# EAGLE board Full (EAGLE 9.6.2), part 1 of 3
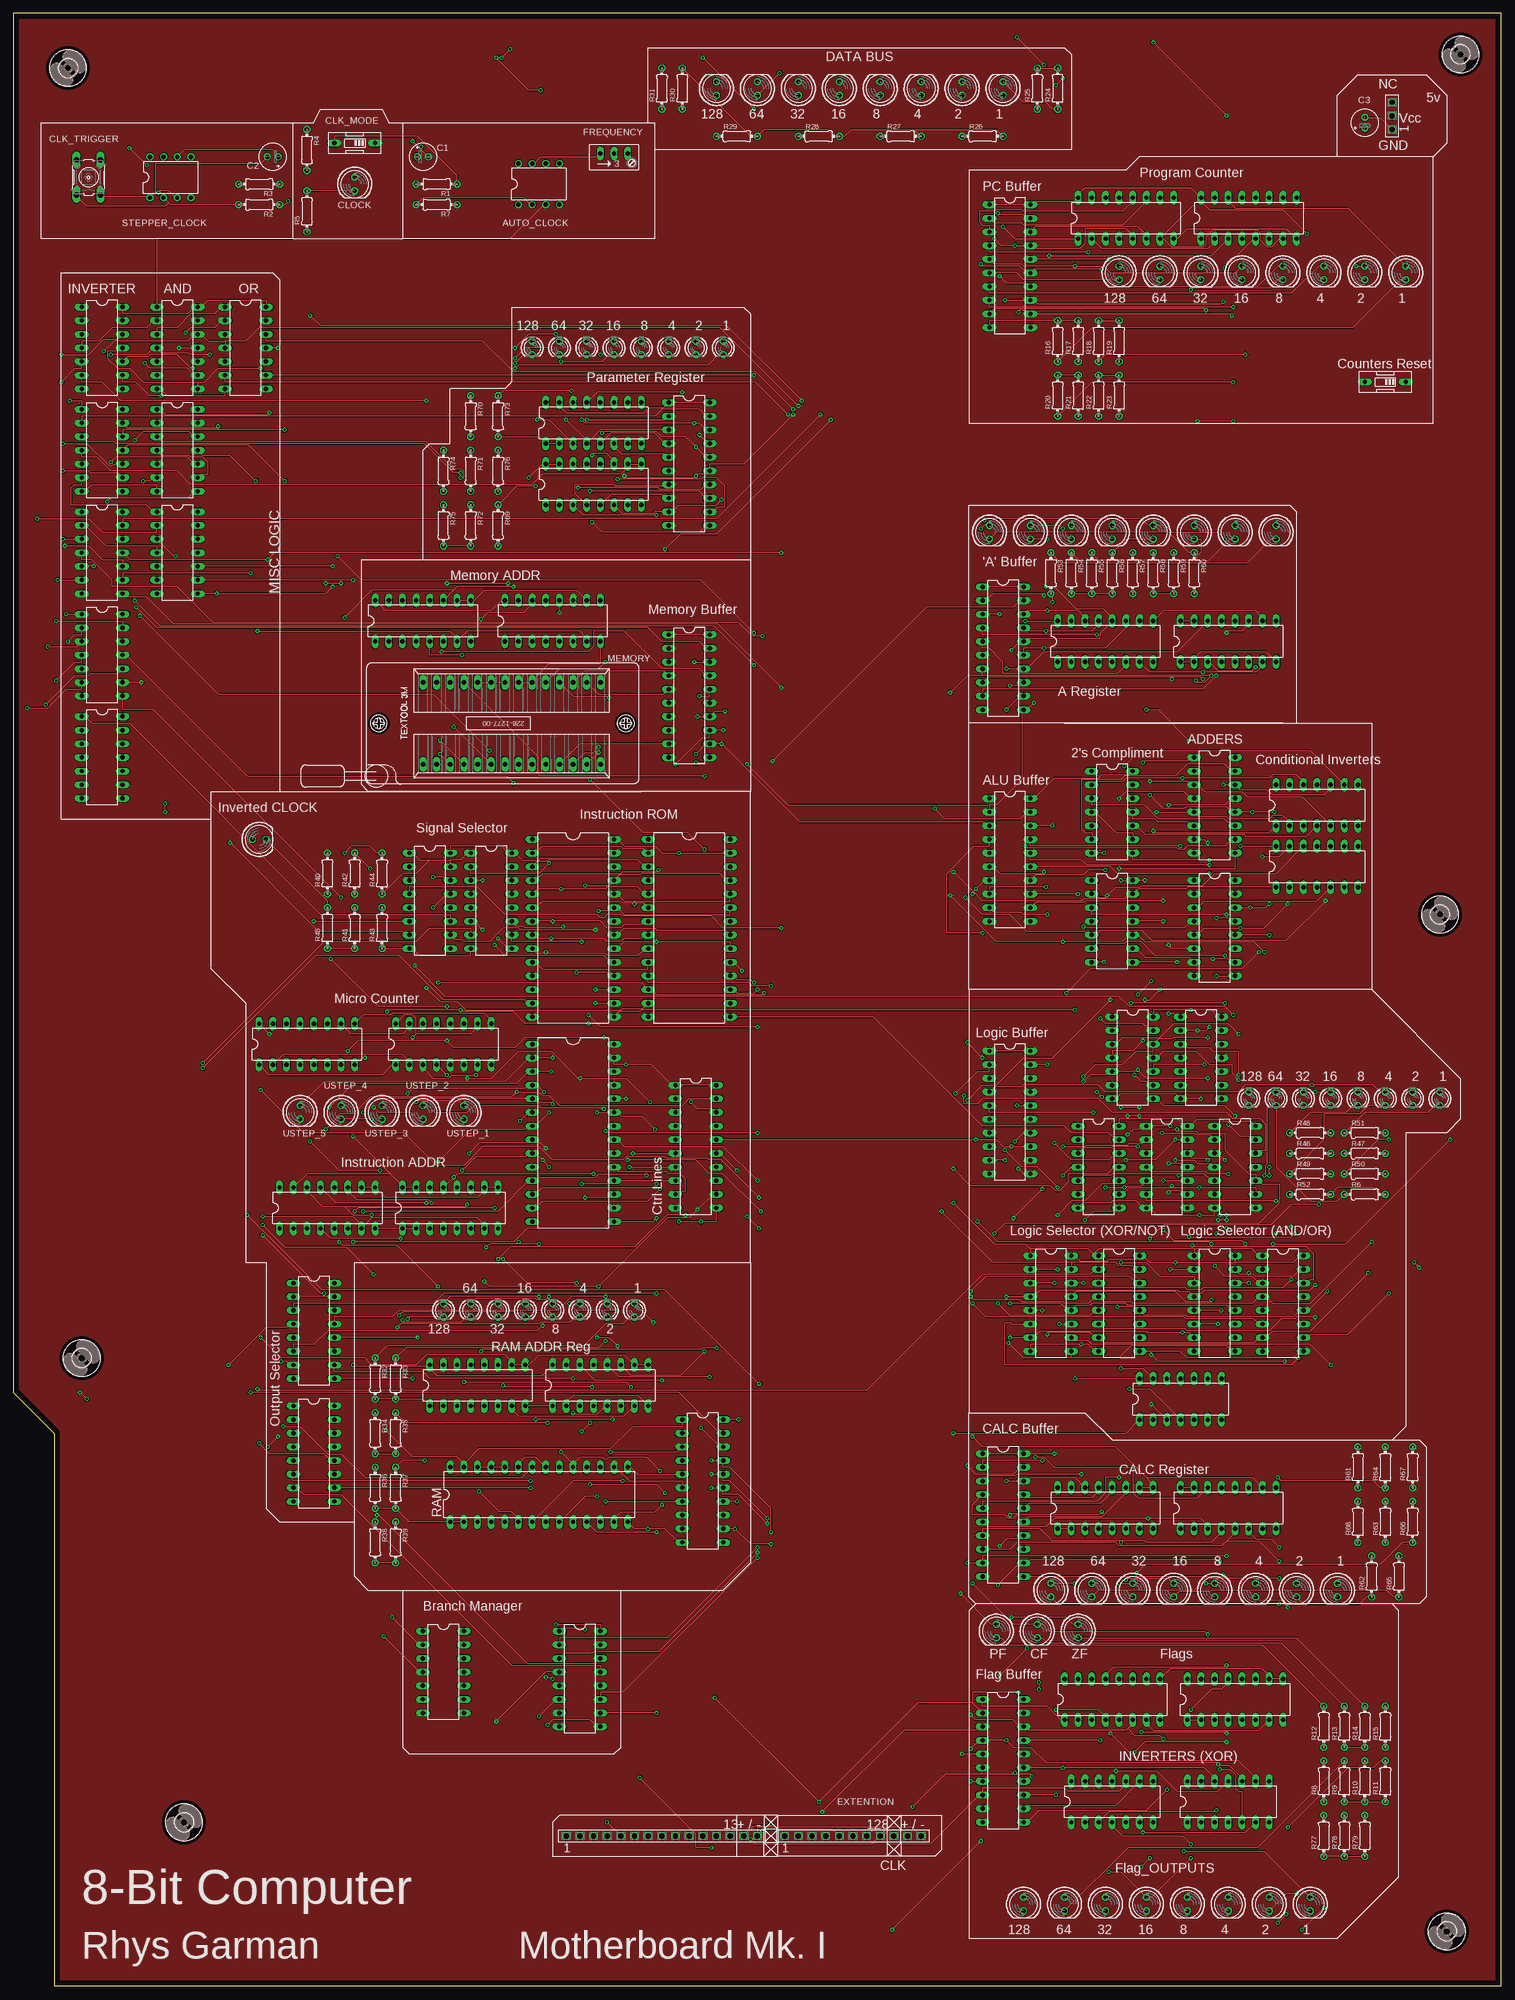
[diagram p5: board, top side]
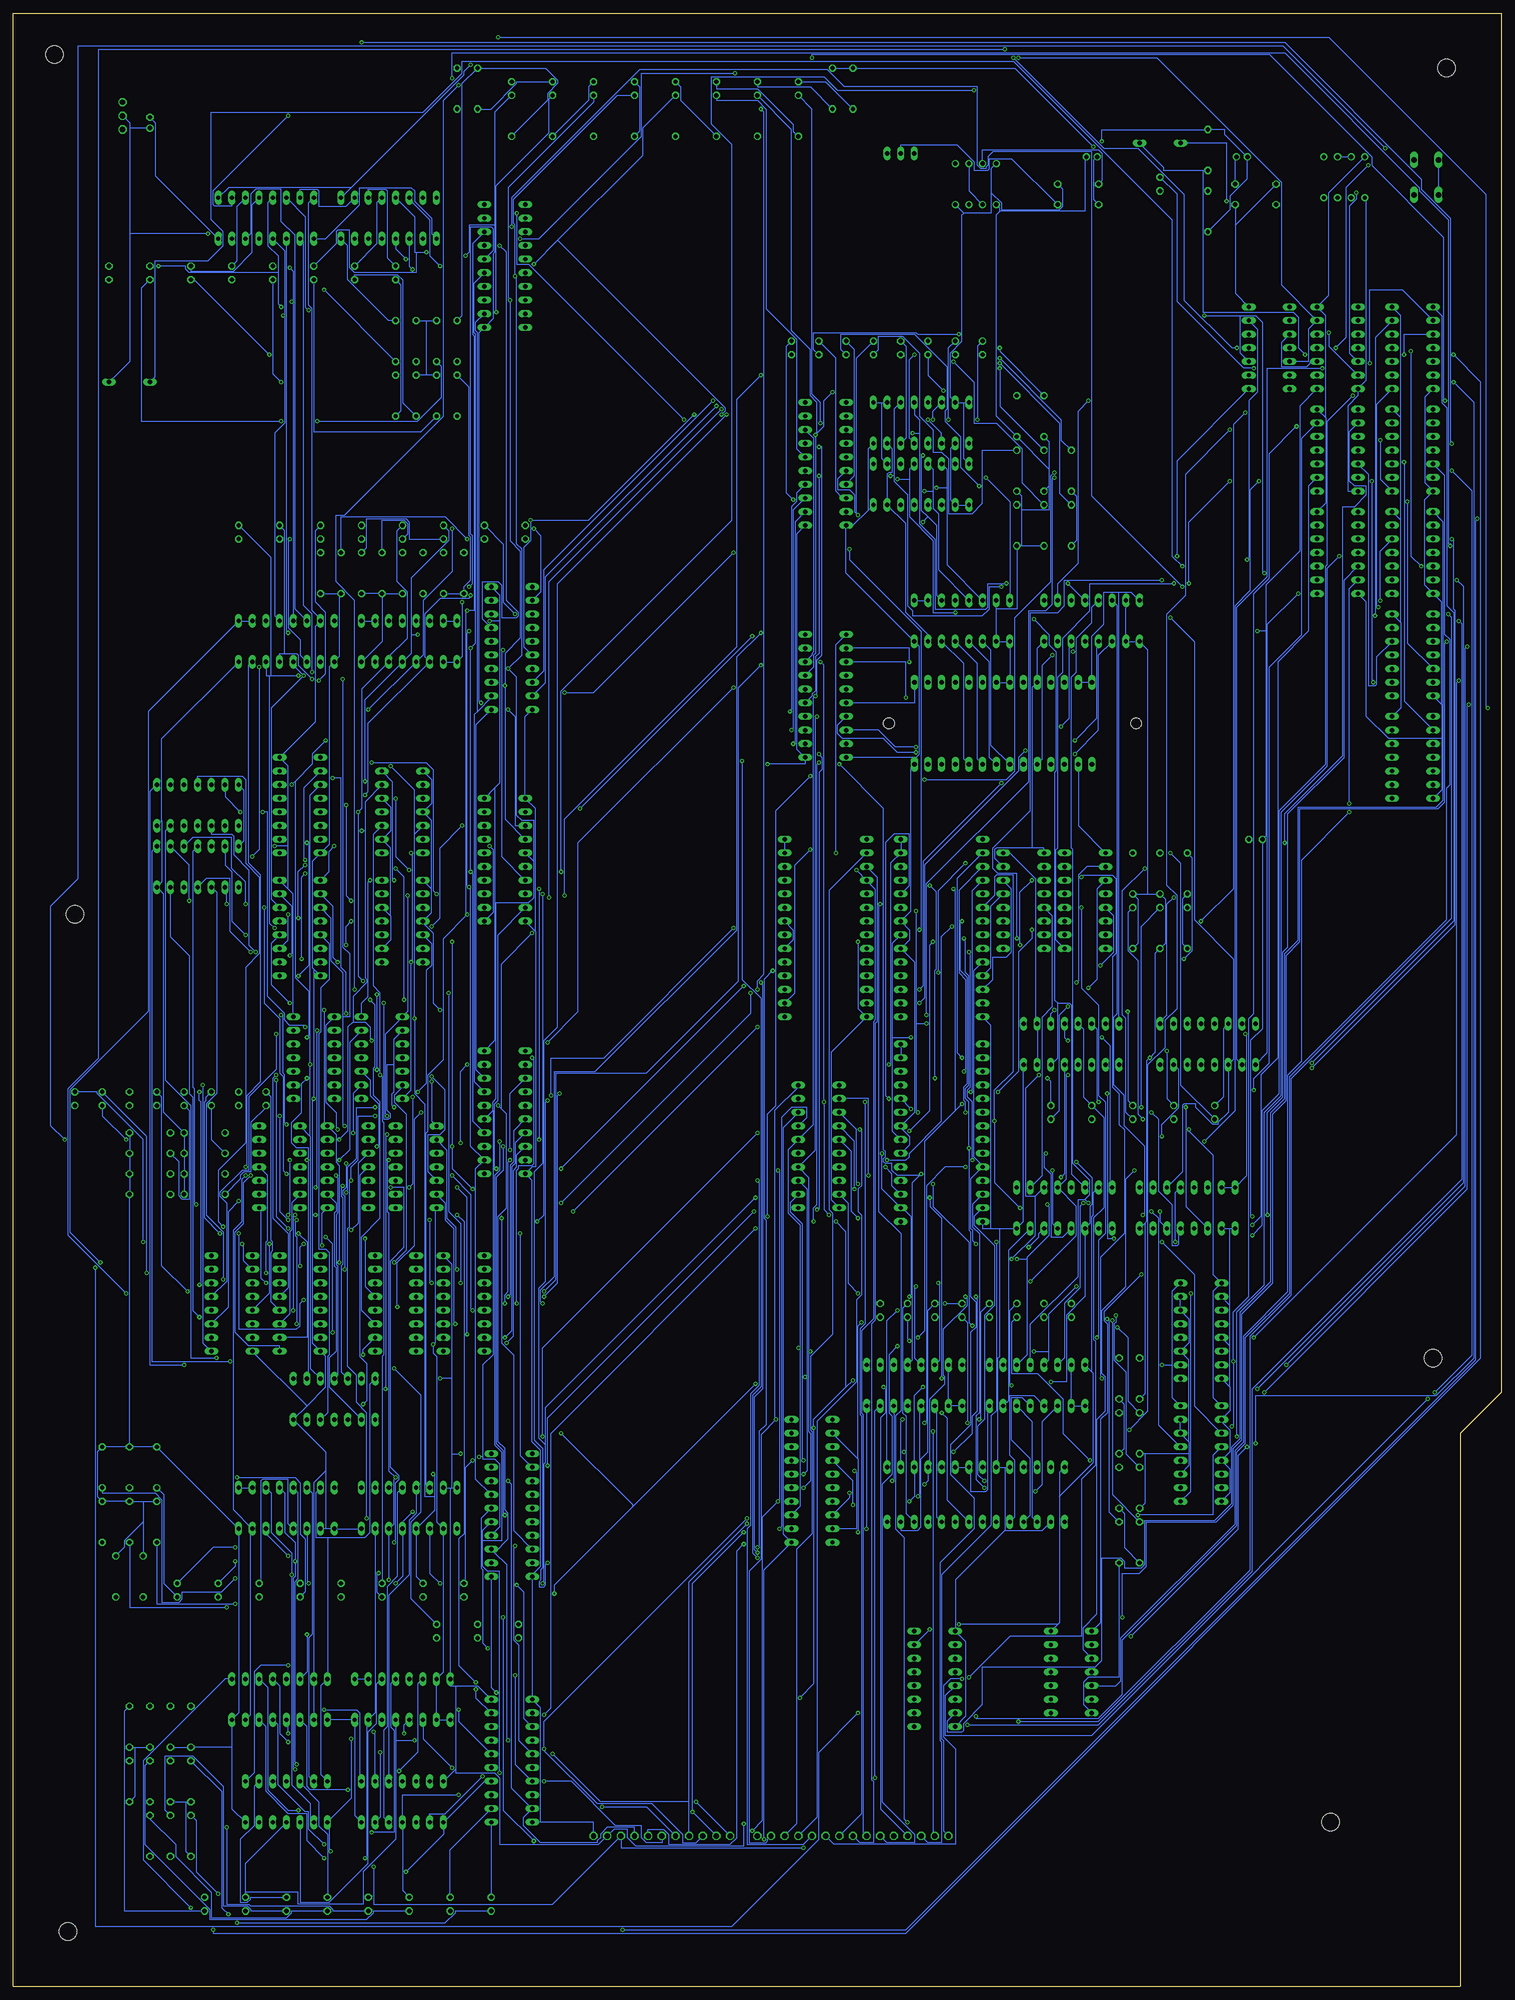
[diagram p6: board, bottom side, seen from below]

Size 276.86 x 367.03 mm. Coordinates in mm from the lower left corner, seen from the top.
Outline: 276.86,367.03 0,367.03 0,110.49 7.62,102.87 7.62,0 276.86,0 276.86,367.03
Copper layers (1*16): Top 0.035mm / dielectric 1.5mm / Bottom 0.035mm
Design rules "default": minimum track width 6mil, minimum drill 0.35mm, track to track 6mil, track to pad 6mil, pad to pad 6mil, via to via 6mil, smd to smd 6mil, copper to edge 40mil, drill to drill 6mil, minimum pad ring 10mil, minimum via ring 8mil, stop-mask expansion 4mil, vias tented up to drill 0mil, thermal gap 10mil

## Footprints (pad centres in the part's own frame; a part is rotated, then mirrored left to right if it is on the bottom)
DIL14 = drill 0.813 long: 1 -7.62,-3.81; 2 -5.08,-3.81; 3 -2.54,-3.81; 4 0,-3.81; 5 2.54,-3.81; 6 5.08,-3.81; 7 7.62,-3.81; 8 7.62,3.81; 9 5.08,3.81; 10 2.54,3.81; 11 0,3.81; 12 -2.54,3.81; 13 -5.08,3.81; 14 -7.62,3.81
DIL16 = drill 0.813 long: 1 -8.89,-3.81; 2 -6.35,-3.81; 3 -3.81,-3.81; 4 -1.27,-3.81; 5 1.27,-3.81; 6 3.81,-3.81; 7 6.35,-3.81; 8 8.89,-3.81; 9 8.89,3.81; 10 6.35,3.81; 11 3.81,3.81; 12 1.27,3.81; 13 -1.27,3.81; 14 -3.81,3.81; 15 -6.35,3.81; 16 -8.89,3.81
DIL08 = drill 0.813 pad 1.27: 1 -3.81,-3.81; 2 -1.27,-3.81; 3 1.27,-3.81; 4 3.81,-3.81; 5 3.81,3.81; 6 1.27,3.81; 7 -1.27,3.81; 8 -3.81,3.81
E2-5 = drill 0.813 pad 1.27: + -1.016,0 | drill 0.813 pad 1.27 octagon: - 1.016,0
EDG-01 = drill 0.813 long: 1 0,-3.81; 2 0,3.81
B3F-10XX = drill 1.016 long: 1 -3.251,2.261; 2 3.251,2.261; 3 -3.251,-2.261; 4 3.251,-2.261
LED5MM = drill 0.813 octagon: A -1.27,0; K 1.27,0
SSW-111-02-G-S = drill 1 pad 1.5 octagon: 1 -12.7,0; 2 -10.16,0; 3 -7.62,0; 4 -5.08,0; 5 -2.54,0; 6 0,0; 7 2.54,0; 8 5.08,0; 9 7.62,0; 10 10.16,0; 11 12.7,0
RJ9W = drill 0.813 long: A 2.54,0.635; E -2.54,0.635; S 0,0.635
DIL28-6 = drill 0.813 long: 1 -16.51,-7.62; 2 -13.97,-7.62; 3 -11.43,-7.62; 4 -8.89,-7.62; 5 -6.35,-7.62; 6 -3.81,-7.62; 7 -1.27,-7.62; 8 1.27,-7.62; 9 3.81,-7.62; 10 6.35,-7.62; 11 8.89,-7.62; 12 11.43,-7.62; 13 13.97,-7.62; 14 16.51,-7.62; 15 16.51,7.62; 16 13.97,7.62; 17 11.43,7.62; 18 8.89,7.62; 19 6.35,7.62; 20 3.81,7.62; 21 1.27,7.62; 22 -1.27,7.62; 23 -3.81,7.62; 24 -6.35,7.62; 25 -8.89,7.62; 26 -11.43,7.62; 27 -13.97,7.62; 28 -16.51,7.62
SSW-115-02-G-S = drill 1 pad 1.5 octagon: 1 -17.78,0; 2 -15.24,0; 3 -12.7,0; 4 -10.16,0; 5 -7.62,0; 6 -5.08,0; 7 -2.54,0; 8 0,0; 9 2.54,0; 10 5.08,0; 11 7.62,0; 12 10.16,0; 13 12.7,0; 14 15.24,0; 15 17.78,0
LED3MM = drill 0.813 octagon: A -1.27,0; K 1.27,0
228-1277-00-0602J = drill 0.9 long: 1 -16.51,-7.62; 2 -13.97,-7.62; 3 -11.43,-7.62; 4 -8.89,-7.62; 5 -6.35,-7.62; 6 -3.81,-7.62; 7 -1.27,-7.62; 8 1.27,-7.62; 9 3.81,-7.62; 10 6.35,-7.62; 11 8.89,-7.62; 12 11.43,-7.62; 13 13.97,-7.62; 14 16.51,-7.62; 15 16.51,7.62; 16 13.97,7.62; 17 11.43,7.62; 18 8.89,7.62; 19 6.35,7.62; 20 3.81,7.62; 21 1.27,7.62; 22 -1.27,7.62; 23 -3.81,7.62; 24 -6.35,7.62; 25 -8.89,7.62; 26 -11.43,7.62; 27 -13.97,7.62; 28 -16.51,7.62 | hole 2: 21.24,0; -24.74,0
DIL20 = drill 0.813 long: 1 -11.43,-3.81; 2 -8.89,-3.81; 3 -6.35,-3.81; 4 -3.81,-3.81; 5 -1.27,-3.81; 6 1.27,-3.81; 7 3.81,-3.81; 8 6.35,-3.81; 9 8.89,-3.81; 10 11.43,-3.81; 11 11.43,3.81; 12 8.89,3.81; 13 6.35,3.81; 14 3.81,3.81; 15 1.27,3.81; 16 -1.27,3.81; 17 -3.81,3.81; 18 -6.35,3.81; 19 -8.89,3.81; 20 -11.43,3.81
0204/7 = drill 0.813 octagon: 1 -3.81,0; 2 3.81,0
DIL28-4 = drill 0.813 long: 1 -16.51,-5.08; 2 -13.97,-5.08; 3 -11.43,-5.08; 4 -8.89,-5.08; 5 -6.35,-5.08; 6 -3.81,-5.08; 7 -1.27,-5.08; 8 1.27,-5.08; 9 3.81,-5.08; 10 6.35,-5.08; 11 8.89,-5.08; 12 11.43,-5.08; 13 13.97,-5.08; 14 16.51,-5.08; 15 16.51,5.08; 16 13.97,5.08; 17 11.43,5.08; 18 8.89,5.08; 19 6.35,5.08; 20 3.81,5.08; 21 1.27,5.08; 22 -1.27,5.08; 23 -3.81,5.08; 24 -6.35,5.08; 25 -8.89,5.08; 26 -11.43,5.08; 27 -13.97,5.08; 28 -16.51,5.08
3,3 = hole 3.3: 0,0
SSW-103-02-G-S = drill 1 pad 1.5 octagon: 1 -2.54,0; 2 0,0; 3 2.54,0

## Placement (x,y rotation side)
4_INP_OR_GATE  4072N  [DIL14]  80.01,58.42 270 top
ADDER_LOWER  74LS283N  [DIL16]  223.52,196.85 270 top
ADDER_UPPER  74LS283N  [DIL16]  223.52,219.71 270 top
ADDR_MEM_REG_LOWER  74LS173N  [DIL16]  100.33,254 0 top
ADDR_MEM_REG_UPPER  74LS173N  [DIL16]  76.2,254 0 top
ADDR_REG_A_LOWER  74LS173N  [DIL16]  226.06,250.19 0 top
ADDR_REG_A_UPPER  74LS173N  [DIL16]  203.2,250.19 0 top
ADDR_REG_CALC_LOWER  74LS173N  [DIL16]  226.06,88.9 0 top
ADDR_REG_CALC_LOWER1  74LS173N  [DIL16]  107.95,279.4 0 top
ADDR_REG_CALC_UPPER  74LS173N  [DIL16]  203.2,88.9 0 top
ADDR_REG_PARAM_UPPER  74LS173N  [DIL16]  107.95,290.83 0 top
AND_GATE1_  74LS08N  [DIL14]  214.63,152.4 270 top
AND_GATE2_  74LS08N  [DIL14]  227.33,152.4 270 top
AND_GATE3_  74LS08N  [DIL14]  30.48,285.75 270 top
AND_GATE4_  74LS08N  [DIL14]  30.48,266.7 270 top
AND_GATE_  74LS08N  [DIL14]  30.48,304.8 270 top
AUTO_CLOCK  NE555N  [DIL08]  97.79,335.28 0 top
BRANCH_SELECTOR  74HC139N  [DIL16]  105.41,57.15 270 top
C1  4.7uF  [E2-5]  76.2,340.36 0 top
C2  0.1uF  [E2-5]  48.26,340.36 180 top
C3  0.1uF  [E2-5]  251.46,346.71 90 top
CLK_MODE  [EDG-01]  63.5,342.9 90 top
CLK_TRIGGER  [B3F-10XX]  13.97,336.55 90 top
CLOCK  [LED5MM]  63.5,335.28 270 top
DATABUS_1  LED  [LED5MM]  184.15,353.06 90 top
DATABUS_2  [LED5MM]  176.53,353.06 90 top
DATABUS_3  [LED5MM]  168.91,353.06 90 top
DATABUS_4  [LED5MM]  161.29,353.06 90 top
DATABUS_5  [LED5MM]  153.67,353.06 90 top
DATABUS_6  [LED5MM]  146.05,353.06 90 top
DATABUS_7  [LED5MM]  138.43,353.06 90 top
DATABUS_8  [LED5MM]  130.81,353.06 90 top
EXTENTION  SSW-111-02-G-S  [SSW-111-02-G-S]  156.21,27.94 0 top
FLAG_1  [LED5MM]  241.3,15.24 270 top
FLAG_2  [LED5MM]  233.68,15.24 270 top
FLAG_3  [LED5MM]  226.06,15.24 270 top
FLAG_4  [LED5MM]  218.44,15.24 270 top
FLAG_5  [LED5MM]  210.82,15.24 270 top
FLAG_6  [LED5MM]  203.2,15.24 270 top
FLAG_7  [LED5MM]  195.58,15.24 270 top
FLAG_8  [LED5MM]  187.96,15.24 270 top
FLAG_REG_LOWER  74LS173N  [DIL16]  227.33,53.34 0 top
FLAG_REG_UPPER  74LS173N  [DIL16]  204.47,53.34 0 top
FREQUENCY  100k  [RJ9W]  111.76,340.36 0 top
INSRUCTION_REGISTER_SELECTOR_LOWER  74LS157N  [DIL16]  55.88,99.06 270 top
INSRUCTION_REGISTER_SELECTOR_UPPER  74LS157N  [DIL16]  55.88,121.92 270 top
INSTRUC_REGISTER_LOWER  74LS173N  [DIL16]  81.28,144.78 0 top
INSTRUC_REGISTER_UPPER  74LS173N  [DIL16]  58.42,144.78 0 top
INSTRUCTION_MEMORY_LOWER  AT28C64B  [DIL28-6]  104.14,158.75 270 top
INSTRUCTION_MEMORY_UPPER  AT28C64B  [DIL28-6]  104.14,196.85 270 top
INSTRUCTION_MEMORY_UPPER2  AT28C64B  [DIL28-6]  125.73,196.85 270 top
INSTRUCTIONS_EXTENSION  SSW-115-02-G-S  [SSW-115-02-G-S]  120.65,27.94 0 top
INVERTED_CLK_LED  [LED5MM]  45.72,213.36 0 top
KILL_SWITCH  [EDG-01]  255.27,298.45 90 top
LED_A_REG_1  [LED5MM]  234.95,270.51 270 top
LED_A_REG_2  [LED5MM]  227.33,270.51 270 top
LED_A_REG_3  [LED5MM]  219.71,270.51 270 top
LED_A_REG_4  [LED5MM]  212.09,270.51 270 top
LED_A_REG_5  [LED5MM]  204.47,270.51 270 top
LED_A_REG_6  [LED5MM]  196.85,270.51 270 top
LED_A_REG_7  [LED5MM]  189.23,270.51 270 top
LED_A_REG_8  [LED5MM]  181.61,270.51 270 top
LED_B_REG_1  [LED5MM]  246.38,73.66 270 top
LED_B_REG_2  [LED5MM]  238.76,73.66 270 top
LED_B_REG_3  [LED5MM]  231.14,73.66 270 top
LED_B_REG_4  [LED5MM]  223.52,73.66 270 top
LED_B_REG_5  [LED5MM]  215.9,73.66 270 top
LED_B_REG_6  [LED5MM]  208.28,73.66 270 top
LED_B_REG_7  [LED5MM]  200.66,73.66 270 top
LED_B_REG_8  [LED5MM]  193.04,73.66 270 top
LOGIC_LED_1  [LED3MM]  265.43,165.1 270 top
LOGIC_LED_2  [LED3MM]  260.35,165.1 270 top
LOGIC_LED_3  [LED3MM]  255.27,165.1 270 top
LOGIC_LED_4  [LED3MM]  250.19,165.1 270 top
LOGIC_LED_5  [LED3MM]  245.11,165.1 270 top
LOGIC_LED_6  [LED3MM]  240.03,165.1 270 top
LOGIC_LED_7  [LED3MM]  234.95,165.1 270 top
LOGIC_LED_8  [LED3MM]  229.87,165.1 270 top
LOGIC_SELECTOR-AND/OR_LOWER  74LS157N  [DIL16]  236.22,127 270 top
LOGIC_SELECTOR-AND/OR_UPPER  74LS157N  [DIL16]  223.52,127 270 top
LOGIC_SELECTOR-XOR/NOT_LOWER  74LS157N  [DIL16]  205.74,127 270 top
LOGIC_SELECTOR-XOR/NOT_UPPER  74LS157N  [DIL16]  193.04,127 270 top
MEMORY  228-1277-00-0602J  [228-1277-00-0602J]  92.71,234.95 0 top
MICRO_COUNTER_LOWER  74LS161  [DIL16]  80.01,175.26 0 top
MICRO_COUNTER_UPPER  74LS161  [DIL16]  54.61,175.26 0 top
NOT_GATE1  74LS04N  [DIL14]  16.51,304.8 270 top
NOT_GATE2_  74LS04N  [DIL14]  16.51,285.75 270 top
NOT_GATE3_  74LS04N  [DIL14]  16.51,266.7 270 top
NOT_GATE4_  74LS04N  [DIL14]  16.51,247.65 270 top
NOT_GATE5_  74LS04N  [DIL14]  16.51,228.6 270 top
NOT_GATE_  74LS04N  [DIL14]  201.93,152.4 270 top
OR_GATE  74LS32N  [DIL14]  208.28,172.72 270 top
OR_GATE1  74LS32N  [DIL14]  43.18,304.8 270 top
OR_GATE_2  74LS32N  [DIL14]  220.98,172.72 270 top
OUTPUT_BUFFER_ALU  74LS245N  [DIL20]  185.42,209.55 270 top
OUTPUT_BUFFER_CALC_REG  74LS245N  [DIL20]  184.15,87.63 270 top
OUTPUT_BUFFER_FLAGS  74HC245N  [DIL20]  184.15,41.91 270 top
OUTPUT_BUFFER_INSTRUCTION  74LS245N  [DIL20]  127,156.21 270 top
OUTPUT_BUFFER_LOGIC  74LS245N  [DIL20]  185.42,162.56 270 top
OUTPUT_BUFFER_MEMORY  74LS245N  [DIL20]  125.73,240.03 270 top
OUTPUT_BUFFER_PARAM_REG  74LS245N  [DIL20]  125.73,283.21 270 top
OUTPUT_BUFFER_PC  74LS245N  [DIL20]  185.42,320.04 270 top
OUTPUT_BUFFER_RAM  74HC245N  [DIL20]  128.27,93.98 270 top
OUTPUT_BUFFER_REG_A  74LS245N  [DIL20]  184.15,248.92 270 top
OVERFLOW_FLAG  [LED5MM]  190.5,66.04 270 top
PARAM_LED_1  [LED3MM]  132.08,304.8 270 top
PARAM_LED_2  [LED3MM]  127,304.8 270 top
PARAM_LED_3  [LED3MM]  121.92,304.8 270 top
PARAM_LED_4  [LED3MM]  116.84,304.8 270 top
PARAM_LED_5  [LED3MM]  111.76,304.8 270 top
PARAM_LED_6  [LED3MM]  106.68,304.8 270 top
PARAM_LED_7  [LED3MM]  101.6,304.8 270 top
PARAM_LED_8  [LED3MM]  96.52,304.8 270 top
PC_1  [LED5MM]  259.08,318.77 270 top
PC_2  [LED5MM]  251.46,318.77 270 top
PC_3  [LED5MM]  243.84,318.77 270 top
PC_4  [LED5MM]  236.22,318.77 270 top
PC_5  [LED5MM]  228.6,318.77 270 top
PC_6  [LED5MM]  220.98,318.77 270 top
PC_7  [LED5MM]  213.36,318.77 270 top
PC_8  [LED5MM]  205.74,318.77 270 top
POSITIVE_FLAG  [LED5MM]  182.88,66.04 270 top
PROGRAM_COUNTER_LOWER  74LS161  [DIL16]  229.87,328.93 0 top
PROGRAM_COUNTER_UPPER  74LS161  [DIL16]  207.01,328.93 0 top
R1  1k  [0204/7]  78.74,335.28 180 top
R2  1k  [0204/7]  45.72,331.47 180 top
R3  10k  [0204/7]  45.72,335.28 180 top
R4  220  [0204/7]  54.61,341.63 270 top
R5  ~220  [0204/7]  54.61,330.2 90 top
R6  ~220  [0204/7]  251.46,147.32 0 top
R7  220  [0204/7]  78.74,331.47 180 top
R8  ~220  [0204/7]  243.84,38.1 90 top
R9  ~220  [0204/7]  247.65,38.1 90 top
R10  ~220  [0204/7]  251.46,38.1 90 top
R11  ~220  [0204/7]  255.27,38.1 90 top
R12  ~220  [0204/7]  243.84,48.26 90 top
R13  ~220  [0204/7]  247.65,48.26 90 top
R14  ~220  [0204/7]  251.46,48.26 90 top
R15  ~220  [0204/7]  255.27,48.26 90 top
R16  ~220  [0204/7]  194.31,306.07 90 top
R17  ~220  [0204/7]  198.12,306.07 90 top
R18  ~220  [0204/7]  201.93,306.07 90 top
R19  ~220  [0204/7]  205.74,306.07 90 top
R20  ~220  [0204/7]  194.31,295.91 90 top
R21  ~220  [0204/7]  198.12,295.91 90 top
R22  ~220  [0204/7]  201.93,295.91 90 top
R23  ~220  [0204/7]  205.74,295.91 90 top
R24  ~220  [0204/7]  194.31,353.06 90 top
R25  ~220  [0204/7]  190.5,353.06 90 top
R26  ~220  [0204/7]  180.34,344.17 0 top
R27  ~220  [0204/7]  165.1,344.17 0 top
R28  ~220  [0204/7]  149.86,344.17 0 top
R29  ~220  [0204/7]  134.62,344.17 0 top
R30  ~220  [0204/7]  124.46,353.06 90 top
R31  ~220  [0204/7]  120.65,353.06 90 top
R32  ~220  [0204/7]  67.31,113.03 270 top
R33  ~220  [0204/7]  71.12,113.03 270 top
R34  ~220  [0204/7]  67.31,102.87 270 top
R35  ~220  [0204/7]  71.12,102.87 270 top
R36  ~220  [0204/7]  67.31,92.71 270 top
R37  ~220  [0204/7]  71.12,92.71 270 top
R38  ~220  [0204/7]  67.31,82.55 270 top
R39  ~220  [0204/7]  71.12,82.55 270 top
R40  ~220  [0204/7]  58.42,207.01 90 top
R41  ~220  [0204/7]  63.5,196.85 90 top
R42  ~220  [0204/7]  63.5,207.01 90 top
R43  ~220  [0204/7]  68.58,196.85 90 top
R44  ~220  [0204/7]  68.58,207.01 90 top
R45  ~220  [0204/7]  58.42,196.85 90 top
R46  ~220  [0204/7]  241.3,154.94 0 top
R47  ~220  [0204/7]  251.46,154.94 0 top
R48  ~220  [0204/7]  241.3,158.75 0 top
R49  ~220  [0204/7]  241.3,151.13 0 top
R50  ~220  [0204/7]  251.46,151.13 0 top
R51  ~220  [0204/7]  251.46,158.75 0 top
R52  ~220  [0204/7]  241.3,147.32 0 top
R53  ~220  [0204/7]  193.04,262.89 270 top
R54  ~220  [0204/7]  196.85,262.89 270 top
R55  ~220  [0204/7]  200.66,262.89 270 top
R56  ~220  [0204/7]  204.47,262.89 270 top
R57  ~220  [0204/7]  208.28,262.89 270 top
R58  ~220  [0204/7]  212.09,262.89 270 top
R59  ~220  [0204/7]  215.9,262.89 270 top
R60  ~220  [0204/7]  219.71,262.89 270 top
R61  ~220  [0204/7]  250.19,96.52 90 top
R62  ~220  [0204/7]  252.73,76.2 90 top
R63  ~220  [0204/7]  255.27,86.36 90 top
R64  ~220  [0204/7]  255.27,96.52 90 top
R65  ~220  [0204/7]  257.81,76.2 90 top
R66  ~220  [0204/7]  260.35,86.36 90 top
R67  ~220  [0204/7]  260.35,96.52 90 top
R68  ~220  [0204/7]  250.19,86.36 90 top
R69  ~220  [0204/7]  90.17,271.78 270 top
R70  ~220  [0204/7]  85.09,292.1 270 top
R71  ~220  [0204/7]  85.09,281.94 270 top
R72  ~220  [0204/7]  85.09,271.78 270 top
R73  ~220  [0204/7]  90.17,292.1 270 top
R74  ~220  [0204/7]  80.01,281.94 270 top
R75  ~220  [0204/7]  80.01,271.78 270 top
R76  ~220  [0204/7]  90.17,281.94 270 top
R77  ~220  [0204/7]  243.84,27.94 90 top
R78  ~220  [0204/7]  247.65,27.94 90 top
R79  ~220  [0204/7]  251.46,27.94 90 top
RAM  71256SA15TPG  [DIL28-4]  97.79,91.44 0 top
RAM_ADDR_LOWER  74LS173N  [DIL16]  109.22,111.76 0 top
RAM_ADDR_UPPER  74LS173N  [DIL16]  86.36,111.76 0 top
RAM_LED_1  [LED3MM]  115.57,125.73 270 top
RAM_LED_2  [LED3MM]  110.49,125.73 270 top
RAM_LED_3  [LED3MM]  105.41,125.73 270 top
RAM_LED_4  [LED3MM]  100.33,125.73 270 top
RAM_LED_5  [LED3MM]  95.25,125.73 270 top
RAM_LED_6  [LED3MM]  90.17,125.73 270 top
RAM_LED_7  [LED3MM]  85.09,125.73 270 top
RAM_LED_8  [LED3MM]  80.01,125.73 270 top
SELECTOR_LOGIC2_  74HC139N  [DIL16]  88.9,201.93 270 top
SELECTOR_LOGIC_  74HC139N  [DIL16]  77.47,201.93 270 top
STEPPER_CLOCK  NE555N  [DIL08]  29.21,336.55 0 top
SUBTRACT_INVRTR_LOWER_  74LS86N  [DIL14]  204.47,198.12 270 top
SUBTRACT_INVRTR_LOWER_1  74LS86N  [DIL14]  242.57,219.71 0 top
SUBTRACT_INVRTR_UPPER_  74LS86N  [DIL14]  204.47,218.44 270 top
SUBTRACT_INVRTR_UPPER_1  74LS86N  [DIL14]  242.57,208.28 0 top
U$1  [3,3]  12.7,116.84 0 top
U$2  [3,3]  10.16,356.87 0 top
U$3  [3,3]  269.24,359.41 0 top
U$4  [3,3]  266.7,10.16 0 top
U$5  [3,3]  31.75,30.48 0 top
U$6  [3,3]  265.43,199.39 0 top
USTEP_1  [LED5MM]  83.82,162.56 270 top
USTEP_2  [LED5MM]  76.2,162.56 270 top
USTEP_3  [LED5MM]  68.58,162.56 270 top
USTEP_4  [LED5MM]  60.96,162.56 270 top
USTEP_5  [LED5MM]  53.34,162.56 270 top
X1  SSW-103-02-G-S  [SSW-103-02-G-S]  256.54,347.98 90 top
XOR_GATE_1  74LS86N  [DIL14]  226.06,34.29 0 top
XOR_GATE_2  74LS86N  [DIL14]  204.47,34.29 0 top
ZERO_FLAG  [LED5MM]  198.12,66.04 270 top
ZERO_POS_FLAG_IDENTIFIER  744078N  [DIL14]  217.17,109.22 0 top

## Tracks (layer width: path | path; a pad name or v marks a point on that pad's centre or on a via)
1_PLACE  (via drill 0.35)
  Top 0.152: v225.74,251.78 226.06,252.09 228.6,252.09 229.87,253.36 ADDR_REG_A_LOWER.11 | 181.61,219.71 OUTPUT_BUFFER_ALU.2 | 181.61,219.71 182.88,219.71 187.64,224.47 187.64,237.49 OUTPUT_BUFFER_REG_A.11 188.59,237.49 v189.87,238.76 | PROGRAM_COUNTER_LOWER.3 222.88,321.94 v192.72,321.94 | 178.44,52.7 OUTPUT_BUFFER_FLAGS.2 | 178.44,52.7 178.44,54.61 v187.01,54.61 | 178.44,52.7 168.28,52.7 v149.86,34.29 v130.49,53.66 | v225.11,76.52 224.79,76.2 OUTPUT_BUFFER_CALC_REG.11 | v107.63,284.8 107.95,285.12 110.49,285.12 111.76,283.84 ADDR_REG_CALC_LOWER1.11 | v107.63,272.41 109.54,270.51 127.64,270.51 128.91,271.78 OUTPUT_BUFFER_PARAM_REG.11 | v86.04,169.54 81.6,169.54 80.96,168.91 78.11,168.91 76.2,170.81 MICRO_COUNTER_LOWER.3 | RAM_ADDR_LOWER.14 108.27,112.71 v120.65,112.71 | v127.95,103.82 131.44,100.33 OUTPUT_BUFFER_RAM.18 | OUTPUT_BUFFER_INSTRUCTION.11 130.81,142.24 v127.95,142.24 v123.83,142.24 | v91.12,135.25 95.57,130.81 v104.78,130.81 | OUTPUT_BUFFER_MEMORY.11 128.59,227.65 v127,227.65 | 181.61,219.71 144.15,219.71 v136.53,227.33
  Bottom 0.152: PROGRAM_COUNTER_LOWER.3 226.06,252.09 v225.74,251.78 | 187.32,327.66 187.32,348.62 DATABUS_1.A | 187.32,327.66 187.32,322.58 187.64,322.26 187.64,310.2 OUTPUT_BUFFER_PC.11 190.18,307.66 190.18,239.08 v189.87,238.76 | OUTPUT_BUFFER_LOGIC.18 190.82,170.5 190.82,234.63 OUTPUT_BUFFER_REG_A.11 | v192.72,321.94 192.09,322.58 192.09,327.66 187.32,327.66 | XOR_GATE_1.2 221.62,31.11 221.62,33.97 225.11,37.47 v225.11,76.52 225.11,80.64 228.92,84.45 228.92,91.76 ADDR_REG_CALC_LOWER.11 | v187.01,54.61 187.96,55.56 OUTPUT_BUFFER_CALC_REG.11 | v149.86,34.29 EXTENTION.1 | ADDR_MEM_REG_LOWER.11 105.09,258.76 105.09,271.78 106.68,273.37 | 106.68,273.37 107.95,274.64 107.95,284.48 v107.63,284.8 | OUTPUT_BUFFER_PARAM_REG.11 131.13,270.19 131.13,230.19 OUTPUT_BUFFER_MEMORY.11 129.54,227.33 v136.53,227.33 | v107.63,272.41 106.68,273.37 | 86.68,147 INSTRUC_REGISTER_LOWER.11 | 86.68,147 88.58,147 88.58,167 v86.04,169.54 | 121.92,111.44 127.95,105.41 v127.95,103.82 127.95,56.2 v130.49,53.66 | 121.92,111.44 v120.65,112.71 | v123.83,142.24 121.92,140.33 121.92,111.44 | 86.68,147 86.68,139.7 v91.12,135.25 | v104.78,130.81 104.46,130.49 104.46,116.52 RAM_ADDR_LOWER.14 | v127,227.65 127.32,227.33 127.32,145.41 127.95,144.78 v127.95,142.24
2_PLACE  (via drill 0.35)
  Top 0.152: v80.65,169.54 MICRO_COUNTER_LOWER.4 | OUTPUT_BUFFER_INSTRUCTION.12 130.18,147.32 v127.32,144.46 125.73,142.88 121.6,142.88 v108.9,130.18 88.58,130.18 v87.63,131.13 | v129.86,97.79 OUTPUT_BUFFER_RAM.17 132.08,96.52 133.35,96.52 140.97,88.9 v140.97,84.45 | XOR_GATE_1.5 228.6,36.19 227.97,36.19 227.33,36.83 227.33,39.37 226.38,40.32 v224.47,40.32 | v183.2,74.61 187.32,78.74 OUTPUT_BUFFER_CALC_REG.12 188.59,78.74 189.23,79.38 224.16,79.38 v224.47,79.06 | v150.5,32.38 165.74,47.62 179.07,47.62 179.7,48.26 OUTPUT_BUFFER_FLAGS.3 | v101.6,255.59 ADDR_MEM_REG_LOWER.12 | v112.4,280.35 127.95,280.35 128.27,280.67 130.81,280.67 132.4,279.08 132.4,275.27 131.13,275.27 130.18,274.32 OUTPUT_BUFFER_PARAM_REG.12 | v184.79,237.49 187.32,240.03 OUTPUT_BUFFER_REG_A.12 | v187.01,311.47 187.32,311.78 187.96,311.78 188.59,311.15 OUTPUT_BUFFER_PC.12 226.38,311.15 v226.69,310.83 | OUTPUT_BUFFER_ALU.3 180.98,215.9 180.34,216.53 146.37,216.53 v131.76,231.14 OUTPUT_BUFFER_MEMORY.12 128.91,231.14 v127,229.23
  Bottom 0.152: v80.65,169.54 80.96,169.23 80.96,150.18 INSTRUC_REGISTER_LOWER.12 79.06,145.1 79.06,139.7 v87.63,131.13 | RAM_ADDR_LOWER.13 109.22,116.84 109.22,129.86 v108.9,130.18 | v129.86,97.79 130.18,98.11 130.18,141.92 132.4,144.14 132.4,145.73 OUTPUT_BUFFER_INSTRUCTION.12 | v224.47,40.32 224.79,40.64 224.79,75.88 224.47,76.2 v224.47,79.06 224.47,82.55 226.38,84.45 226.38,91.76 ADDR_REG_CALC_LOWER.12 | OUTPUT_BUFFER_FLAGS.3 181.93,49.85 181.93,73.34 v183.2,74.61 | EXTENTION.2 v150.5,32.38 150.5,74.93 v140.97,84.45 | v101.6,255.59 105.73,255.59 105.73,268.92 110.17,273.37 110.17,280.35 | 110.17,280.35 110.17,282.26 ADDR_REG_CALC_LOWER1.12 | v131.76,231.14 131.44,231.46 131.44,272.41 OUTPUT_BUFFER_PARAM_REG.12 | v112.4,280.35 110.17,280.35 | ADDR_REG_A_LOWER.12 228.28,254.95 228.28,288.93 226.38,290.83 226.38,310.83 | 226.38,310.83 226.38,322.9 PROGRAM_COUNTER_LOWER.4 | OUTPUT_BUFFER_ALU.3 183.51,215.9 183.51,236.22 v184.79,237.49 | OUTPUT_BUFFER_LOGIC.17 191.13,168.27 191.13,236.54 190.5,237.17 | 190.5,237.17 187.96,239.71 OUTPUT_BUFFER_REG_A.12 | OUTPUT_BUFFER_PC.12 190.82,309.56 190.82,307.98 190.5,307.66 190.5,237.17 | DATABUS_2.A 177.17,351.15 177.17,344.81 187.01,334.96 v187.01,311.47 | v226.69,310.83 226.38,310.83 | v127.32,144.46 127,144.46 127,225.74 126.37,226.38 126.37,228.6 v127,229.23
4_PLACE  (via drill 0.35)
  Top 0.152: v132.08,233.68 OUTPUT_BUFFER_MEMORY.13 129.54,232.41 128.27,232.41 v123.19,227.33 | v107.31,278.13 127.64,278.13 128.91,276.86 OUTPUT_BUFFER_PARAM_REG.13 | INSTRUC_REGISTER_LOWER.13 v81.92,150.5 82.55,151.13 v107.95,151.13 | v129.86,95.25 OUTPUT_BUFFER_RAM.16 132.08,93.98 133.35,93.98 v140.34,87 | RAM_ADDR_LOWER.12 112.71,113.35 v129.54,113.35 | v225.43,319.72 230.82,325.12 PROGRAM_COUNTER_LOWER.5 | v185.42,241.94 186.69,241.94 187.32,242.57 OUTPUT_BUFFER_REG_A.13 | v184.47,313.69 OUTPUT_BUFFER_PC.13 189.87,313.69 190.5,313.06 224.79,313.06 v225.11,313.37 | XOR_GATE_1.10 228.6,38.73 226.38,40.96 224.47,40.96 v224.16,41.28 223.84,41.59 192.09,41.59 189.23,44.45 186.06,44.45 v184.79,45.72 OUTPUT_BUFFER_FLAGS.4 179.7,45.72 v178.12,44.13 | v186.69,163.83 OUTPUT_BUFFER_LOGIC.16 | OUTPUT_BUFFER_ALU.4 181.61,212.09 178.75,212.09 173.67,207.01 173.67,195.9 v180.34,195.9
  Bottom 0.152: ADDR_MEM_REG_LOWER.13 104.78,263.52 104.78,274 105.73,274.95 105.73,278.13 | 105.73,278.13 105.73,282.26 ADDR_REG_CALC_LOWER1.13 | v132.08,233.68 131.76,234 131.76,274.64 OUTPUT_BUFFER_PARAM_REG.13 | v107.31,278.13 105.73,278.13 | v81.92,150.5 81.28,151.13 MICRO_COUNTER_LOWER.5 | v129.86,95.25 129.22,95.88 129.22,113.35 | 129.22,113.35 129.22,148.27 OUTPUT_BUFFER_INSTRUCTION.13 | 129.22,113.35 v129.54,113.35 | 108.27,150.81 109.54,149.54 109.54,116.52 RAM_ADDR_LOWER.12 | 108.27,150.81 v107.95,151.13 | v123.19,227.33 114.94,219.07 114.94,155.57 114.62,155.26 114.62,154.31 114.94,153.99 114.94,153.35 114.62,153.03 113.35,153.03 113.35,151.76 112.4,150.81 108.27,150.81 | 224.79,313.37 224.79,319.09 v225.43,319.72 | 224.79,313.37 ADDR_REG_A_LOWER.13 | OUTPUT_BUFFER_ALU.4 185.42,217.17 v185.42,241.94 185.42,247.97 182.56,250.82 182.56,267.02 184.47,268.92 v184.47,313.69 184.79,314.01 184.79,334.64 168.91,350.52 DATABUS_3.A | v225.11,313.37 224.79,313.37 | ADDR_REG_CALC_LOWER.13 223.84,91.76 223.84,75.88 224.47,75.25 224.47,41.59 v224.16,41.28 | v184.79,45.72 185.1,46.04 185.1,78.42 187.32,80.64 | 186.06,163.19 185.1,162.24 185.1,144.78 186.69,143.19 186.69,101.28 185.42,100.01 185.42,88.58 184.79,87.95 184.79,83.19 187.32,80.64 | 186.06,163.19 v186.69,163.83 | 187.32,80.64 OUTPUT_BUFFER_CALC_REG.13 | EXTENTION.3 149.86,26.67 152.4,26.67 152.4,28.26 158.12,33.97 168.28,33.97 178.12,43.81 v178.12,44.13 178.12,49.21 v140.34,87 | v180.34,195.9 186.06,190.18 186.06,163.19
8_PLACE  (via drill 0.35)
  Top 0.152: v132.4,237.17 130.49,237.17 OUTPUT_BUFFER_MEMORY.14 v127.32,236.22 | v105.09,278.76 120.02,278.76 120.33,278.45 127.95,278.45 128.91,279.4 OUTPUT_BUFFER_PARAM_REG.14 | v87,254.32 88.27,255.59 94.93,255.59 96.52,257.18 ADDR_MEM_REG_LOWER.14 | RAM_ADDR_LOWER.11 114.94,113.66 124.14,113.66 v128.59,118.11 | v129.86,92.71 OUTPUT_BUFFER_RAM.15 132.08,91.44 134.94,91.44 v140.34,86.04 | v183.51,318.13 184.79,316.87 187.96,316.87 188.59,316.23 OUTPUT_BUFFER_PC.14 | v176.53,43.18 OUTPUT_BUFFER_FLAGS.5 | v184.79,245.11 OUTPUT_BUFFER_REG_A.14 188.59,245.11 191.77,248.28 216.53,248.28 ADDR_REG_A_LOWER.14 | v183.51,81.91 184.79,83.19 186.69,83.19 187.32,83.82 OUTPUT_BUFFER_CALC_REG.14 | ADDR_REG_CALC_LOWER.14 220.34,90.8 209.23,90.8 208.28,91.76 208.28,96.52 193.68,96.52 191.77,98.42 v190.18,98.42
  Bottom 0.152: INSTRUC_REGISTER_LOWER.14 80.01,151.13 80.01,182.56 80.33,182.88 82.55,182.88 | 82.55,182.88 82.55,172.72 MICRO_COUNTER_LOWER.6 | ADDR_MEM_REG_LOWER.14 103.19,264.48 103.19,278.76 | 103.19,278.76 103.19,282.26 ADDR_REG_CALC_LOWER1.14 | v132.4,237.17 132.08,237.49 132.08,275.27 131.13,276.23 131.13,277.81 OUTPUT_BUFFER_PARAM_REG.14 | v105.09,278.76 103.19,278.76 | 82.55,182.88 83.19,183.51 83.19,225.74 82.87,226.06 82.87,248.28 84.14,249.56 84.14,251.46 v87,254.32 | 128.91,118.43 v128.59,118.11 | 128.91,118.43 128.91,150.5 OUTPUT_BUFFER_INSTRUCTION.14 127.64,155.57 127.64,235.9 v127.32,236.22 | v129.86,92.71 128.59,93.98 128.59,102.87 128.91,103.19 128.91,118.43 | DATABUS_4.A 164.47,351.79 183.83,332.42 183.83,327.98 183.51,327.66 v183.51,318.13 183.2,317.82 183.2,268.29 182.25,267.33 182.25,247.65 v184.79,245.11 183.2,243.52 183.2,217.8 182.25,216.85 180.02,216.85 180.02,209.23 | XOR_GATE_1.13 221.93,39.05 221.93,64.77 221.3,65.41 221.3,91.76 ADDR_REG_CALC_LOWER.14 | v176.53,43.18 167.64,34.29 151.13,34.29 | EXTENTION.4 151.13,34.29 | 180.02,209.23 OUTPUT_BUFFER_ALU.5 | 180.02,209.23 180.02,202.56 180.98,201.61 187.01,201.61 187.01,165.1 187.64,164.46 187.64,162.88 | OUTPUT_BUFFER_LOGIC.15 187.64,162.88 | OUTPUT_BUFFER_CALC_REG.14 186.37,85.41 186.37,97.15 187.32,98.11 189.55,98.11 189.55,98.42 | 189.55,98.42 189.55,115.57 187.64,117.47 187.64,162.88 | PROGRAM_COUNTER_LOWER.6 232.73,326.07 232.73,333.38 231.78,334.33 227.01,334.33 227.01,328.29 224.47,325.75 224.47,256.22 ADDR_REG_A_LOWER.14 | OUTPUT_BUFFER_FLAGS.5 182.88,45.72 182.88,63.5 183.83,64.45 183.83,81.6 v183.51,81.91
  Bottom 0.152: 189.55,98.42 v190.18,98.42 | v140.34,86.04 151.13,75.25 151.13,34.29
16_PLACE  (via drill 0.35)
  Top 0.152: v77.79,145.73 77.15,146.37 63.82,146.37 62.23,147.95 INSTRUC_REGISTER_UPPER.11 | 81.92,259.71 82.55,260.35 v93.03,260.35 | 81.92,259.71 ADDR_MEM_REG_UPPER.11 | v113.67,280.99 113.98,280.67 126.68,280.67 v127,280.99 127.32,281.31 128.27,281.31 128.91,281.94 OUTPUT_BUFFER_PARAM_REG.15 129.54,283.21 135.89,283.21 v145.1,292.42 | v61.6,254.63 66.68,259.71 81.92,259.71 | v134.62,90.17 OUTPUT_BUFFER_RAM.14 | v134.62,151.76 131.44,154.94 OUTPUT_BUFFER_INSTRUCTION.15 | OUTPUT_BUFFER_CALC_REG.15 188.91,87.31 202.56,87.31 207.01,91.76 ADDR_REG_CALC_UPPER.11 | 180.34,39.37 OUTPUT_BUFFER_FLAGS.6 | 186.37,39.37 189.23,39.37 v189.55,39.05 | 186.37,39.37 180.34,39.37 | v167.32,33.34 173.36,39.37 180.34,39.37 | 186.37,39.37 v186.37,39.69 | v139.38,28.89 139.7,29.21 152.4,29.21 EXTENTION.5 | v202.56,319.4 189.87,319.4 OUTPUT_BUFFER_PC.15 188.59,318.77 187.32,320.04 180.34,320.04 v180.02,320.36 | OUTPUT_BUFFER_REG_A.15 187.96,248.92 v191.77,248.92 203.2,248.92 207.01,252.73 ADDR_REG_A_UPPER.11 | v191.77,207.33 191.45,207.01 183.51,207.01 182.25,208.28 OUTPUT_BUFFER_ALU.6 | v186.37,157.16 188.28,159.07 188.91,159.07 OUTPUT_BUFFER_LOGIC.14
  Bottom 0.152: INSTRUC_REGISTER_UPPER.11 59.37,151.45 59.37,163.83 59.06,164.15 56.83,164.15 56.83,163.51 53.66,160.34 52.71,160.34 52.71,160.65 50.8,162.56 MICRO_COUNTER_UPPER.3 49.85,172.4 49.85,191.13 57.15,198.44 57.15,250.19 v61.6,254.63 | RAM_ADDR_UPPER.14 81.28,116.84 81.28,127 78.42,129.86 78.42,145.1 v77.79,145.73 | OUTPUT_BUFFER_MEMORY.15 128.27,240.03 128.27,240.35 127.64,240.98 127.64,247.33 127,247.97 v127,280.99 | v93.03,260.35 95.25,260.35 95.25,256.22 96.52,254.95 109.54,254.95 109.54,255.91 110.49,256.86 110.49,277.5 113.03,280.03 113.03,280.99 | 113.03,280.99 113.03,293.37 ADDR_REG_PARAM_UPPER.11 | 113.03,280.99 v113.67,280.99 | v134.62,151.76 134.3,151.45 134.3,90.49 v134.62,90.17 137.48,87.31 137.48,30.8 v139.38,28.89 | v189.55,39.05 196.53,32.07 199.39,32.07 XOR_GATE_2.2 | EXTENTION.5 159.07,33.34 v167.32,33.34 | OUTPUT_BUFFER_CALC_REG.15 189.55,84.77 189.55,82.87 | 189.55,82.87 189.55,78.1 188.59,77.15 186.37,77.15 v186.37,39.69 | v202.56,319.4 203.2,320.04 PROGRAM_COUNTER_UPPER.3 | DATABUS_5.A 159.7,345.76 159.7,340.68 175.58,324.8 | v180.02,320.36 175.58,324.8 | OUTPUT_BUFFER_LOGIC.14 191.45,160.97 191.45,207.01 v191.77,207.33 v191.77,248.92 190.82,249.87 190.82,307.34 191.13,307.66 191.13,316.87 OUTPUT_BUFFER_PC.15 | 189.55,82.87 186.06,82.87 186.06,99.38 187.32,100.65 187.32,150.81 186.37,151.76 v186.37,157.16 | v145.1,292.42 144.46,293.05 144.46,293.69 175.58,324.8
32_PLACE  (via drill 0.35)
  Top 0.152: v178.12,38.1 OUTPUT_BUFFER_FLAGS.7 | ADDR_REG_CALC_UPPER.12 204.47,92.07 202.25,89.85 188.91,89.85 OUTPUT_BUFFER_CALC_REG.16 187.01,87.95 185.74,87.95 v185.42,87.63 | v188.59,62.86 v183.51,57.78 | v203.84,321.31 OUTPUT_BUFFER_PC.16 | v185.74,248.6 187.32,250.19 OUTPUT_BUFFER_REG_A.16 188.59,250.19 189.23,250.82 202.25,250.82 202.25,251.78 ADDR_REG_A_UPPER.12 204.47,254.63 202.88,256.22 197.8,256.22 193.68,260.35 v192.09,260.35 | OUTPUT_BUFFER_LOGIC.13 v185.74,156.21 184.15,156.21 182.88,157.48 v179.07,157.48 OUTPUT_BUFFER_INSTRUCTION.16 | v179.07,204.15 180.66,205.74 OUTPUT_BUFFER_ALU.7 | v92.08,260.99 v80.65,260.99 | v109.54,288.93 109.86,289.24 119.7,289.24 120.65,288.29 125.09,288.29 v127,286.38 128.91,284.48 OUTPUT_BUFFER_PARAM_REG.16 | v60.64,138.43 61.28,137.79 71.44,137.79 v79.06,130.18 | OUTPUT_BUFFER_MEMORY.16 129.54,240.03 v127.64,240.03 | v87,118.11 87.31,118.43 127.95,118.43 128.27,118.74 v130.81,118.74
  Bottom 0.152: v178.12,38.1 173.04,38.1 164.78,29.84 160.02,29.84 160.02,27.62 159.07,26.67 156.21,26.67 EXTENTION.6 | XOR_GATE_2.5 207.96,31.43 207.96,47.62 207.33,48.26 207.33,74.29 205.42,76.2 205.42,91.76 ADDR_REG_CALC_UPPER.12 | OUTPUT_BUFFER_FLAGS.7 183.51,41.28 v183.51,57.78 | v188.59,62.86 189.55,63.82 189.55,77.47 189.87,77.79 189.87,87 OUTPUT_BUFFER_CALC_REG.16 | v203.84,321.31 205.74,323.21 PROGRAM_COUNTER_UPPER.4 | OUTPUT_BUFFER_ALU.7 186.06,210.19 186.06,248.28 v185.74,248.6 | v179.07,204.15 v179.07,157.48 | OUTPUT_BUFFER_PC.16 187.64,322.9 187.64,327.02 187.96,327.34 191.77,327.34 191.77,270.19 191.45,269.88 191.45,260.99 v192.09,260.35 | v185.42,87.63 185.74,87.95 185.74,99.69 187.01,100.96 187.01,150.5 185.74,151.76 v185.74,156.21 | v80.65,260.99 ADDR_MEM_REG_UPPER.12 | v92.08,260.99 95.57,260.99 95.57,256.54 95.89,256.22 105.41,256.22 105.41,269.24 108.27,272.1 108.27,288.93 | 108.27,288.93 108.27,291.46 109.22,292.42 ADDR_REG_PARAM_UPPER.12 | OUTPUT_BUFFER_PARAM_REG.16 131.13,286.07 131.13,306.39 136.84,312.1 136.84,349.25 138.43,350.84 146.05,350.84 DATABUS_6.A | v109.54,288.93 108.27,288.93 | INSTRUC_REGISTER_UPPER.12 60.64,147.64 v60.64,138.43 | v79.06,130.18 84.14,125.09 84.14,118.11 | 84.14,118.11 84.14,116.52 RAM_ADDR_UPPER.13 | OUTPUT_BUFFER_RAM.13 130.49,89.22 130.49,118.74 | 130.49,118.74 130.49,141.6 132.72,143.83 132.72,155.57 OUTPUT_BUFFER_INSTRUCTION.16 127.95,160.34 127.95,239.71 v127.64,240.03 127.32,240.35 127.32,246.7 126.37,247.65 126.37,286.38 v127,286.38 | v87,118.11 84.14,118.11 | 130.49,118.74 v130.81,118.74
64_PLACE  (via drill 0.35)
  Top 0.152: INSTRUC_REGISTER_UPPER.13 60.01,145.73 v76.84,145.73 | v127.64,288.61 129.22,287.02 OUTPUT_BUFFER_PARAM_REG.17 | ADDR_REG_PARAM_UPPER.13 108.59,296.54 v124.46,296.54 | OUTPUT_BUFFER_RAM.12 v134.3,85.09 137.16,82.23 v140.97,82.23 | XOR_GATE_2.10 207.01,37.47 205.74,36.19 196.22,36.19 195.58,36.83 180.34,36.83 OUTPUT_BUFFER_FLAGS.8 179.7,35.56 170.5,26.35 162.56,26.35 162.56,28.26 161.61,29.21 160.02,29.21 EXTENTION.7 | PROGRAM_COUNTER_UPPER.5 208.28,325.75 207.01,327.02 199.39,327.02 199.39,324.17 198.44,323.21 189.87,323.21 OUTPUT_BUFFER_PC.17 v186.37,323.85 183.83,323.85 v182.56,325.12 | OUTPUT_BUFFER_REG_A.17 188.59,252.09 v192.09,252.09 200.66,252.09 201.93,253.36 ADDR_REG_A_UPPER.13 | OUTPUT_BUFFER_CALC_REG.17 188.59,90.8 200.66,90.8 201.93,92.07 ADDR_REG_CALC_UPPER.13 | OUTPUT_BUFFER_ALU.8 181.61,204.47 v192.09,204.47 | v142.56,355.92 DATABUS_7.A | v79.69,248.28 107,248.28 107.95,249.24 107.95,252.09 113.67,252.09 120.65,245.11 127.64,245.11 128.91,243.84 OUTPUT_BUFFER_MEMORY.17
  Bottom 0.152: 77.47,146.37 v76.84,145.73 | 77.47,146.37 78.74,146.37 78.74,132.08 87.63,123.19 RAM_ADDR_UPPER.12 | ADDR_MEM_REG_UPPER.13 76.2,256.54 76.2,253.68 79.06,250.82 79.06,248.28 | 79.06,248.28 79.06,244.47 80.01,243.52 80.01,211.77 79.69,211.45 79.69,153.03 76.52,149.86 76.52,147.32 77.47,146.37 | OUTPUT_BUFFER_MEMORY.17 127.95,245.43 127.95,247.65 127.64,247.97 v127.64,288.61 127.32,288.93 | v124.46,296.54 126.05,294.96 126.05,290.19 127.32,288.93 | DATABUS_7.A 132.08,345.44 132.08,307.98 128.59,304.48 128.59,295.91 127.32,294.64 127.32,288.93 | v134.3,85.09 133.99,85.41 133.99,161.61 132.08,163.51 129.22,163.51 129.22,161.61 OUTPUT_BUFFER_INSTRUCTION.17 | OUTPUT_BUFFER_CALC_REG.17 190.82,94.3 190.82,152.08 OUTPUT_BUFFER_LOGIC.12 191.77,156.21 191.77,204.15 v192.09,204.47 192.41,204.79 192.41,251.78 v192.09,252.09 | v186.37,323.85 185.1,322.58 185.1,257.81 182.88,255.59 182.88,254.95 183.2,254.63 186.06,254.63 186.06,260.67 186.69,261.3 189.55,261.3 189.55,254.32 OUTPUT_BUFFER_REG_A.17 | XOR_GATE_2.10 207.01,72.71 203.2,76.52 203.2,86.68 201.93,87.95 ADDR_REG_CALC_UPPER.13 | v140.97,82.23 142.24,80.96 142.24,27.62 143.51,26.35 154.94,26.35 154.94,28.26 155.89,29.21 158.75,29.21 EXTENTION.7 | v142.56,355.92 160.02,355.92 160.02,344.17 179.07,325.12 v182.56,325.12 | v79.69,248.28 79.06,248.28
128_PLACE  (via drill 0.35)
  Top 0.152: v187.01,152.08 188.28,150.81 188.91,150.81 OUTPUT_BUFFER_LOGIC.11 | OUTPUT_BUFFER_REG_A.18 188.59,255.91 v192.41,255.91 198.12,255.91 199.39,254.63 ADDR_REG_A_UPPER.14 | OUTPUT_BUFFER_PC.18 190.18,327.34 209.23,327.34 210.82,325.75 PROGRAM_COUNTER_UPPER.6 | OUTPUT_BUFFER_ALU.9 182.56,199.71 187.64,199.71 187.96,199.39 v192.41,199.39 | v84.46,145.41 84.14,145.1 61.6,145.1 | 61.6,145.1 57.47,145.1 54.61,147.95 INSTRUC_REGISTER_UPPER.14 | v66.68,143.51 63.18,143.51 61.6,145.1 | v105.73,291.46 106.36,290.83 v126.68,290.83 127.64,290.83 128.91,289.56 OUTPUT_BUFFER_PARAM_REG.18 | ADDR_REG_CALC_UPPER.14 197.49,94.61 189.23,94.61 188.59,93.98 OUTPUT_BUFFER_CALC_REG.18 v184.79,93.98 | v137.16,27.3 138.11,26.35 159.7,26.35 EXTENTION.8 | v126.68,246.38 OUTPUT_BUFFER_MEMORY.18 | v126.05,164.46 127.32,163.19 129.54,163.19 130.18,162.56 OUTPUT_BUFFER_INSTRUCTION.18 | v90.17,135.25 92.39,137.48 115.57,137.48 121.6,143.51 v125.09,143.51
  Bottom 0.152: OUTPUT_BUFFER_ALU.9 186.69,195.58 186.69,164.78 187.32,164.15 187.32,152.4 v187.01,152.08 | OUTPUT_BUFFER_PC.18 191.45,324.17 191.45,307.34 191.13,307.02 191.13,255.91 v192.41,255.91 192.72,255.59 192.72,199.71 v192.41,199.39 196.85,194.94 196.85,172.4 199.71,169.54 199.71,159.07 200.03,158.75 200.03,93.34 ADDR_REG_CALC_UPPER.14 | RAM_ADDR_UPPER.11 88.27,117.47 88.27,135.25 | 88.27,135.25 88.27,135.57 84.14,139.7 84.14,145.1 v84.46,145.41 | ADDR_MEM_REG_UPPER.14 71.44,256.86 71.44,180.97 72.07,180.34 72.07,167.64 70.17,165.73 70.17,160.02 66.36,156.21 66.36,143.83 v66.68,143.51 | OUTPUT_BUFFER_MEMORY.18 128.27,247.65 128.27,247.97 127.95,248.28 127.95,287.97 OUTPUT_BUFFER_PARAM_REG.18 | ADDR_REG_PARAM_UPPER.14 105.73,293.05 v105.73,291.46 | DATABUS_8.A 128.27,349.25 128.27,296.23 126.68,294.64 v126.68,290.83 | OUTPUT_BUFFER_INSTRUCTION.18 133.67,159.7 133.67,84.14 OUTPUT_BUFFER_RAM.11 137.16,77.47 v137.16,27.3 | EXTENTION.8 161.29,29.53 166.37,29.53 167.64,28.26 167.64,27.62 168.28,26.99 168.28,26.67 178.75,26.67 181.93,29.84 181.93,31.43 OUTPUT_BUFFER_FLAGS.9 184.15,36.83 184.15,93.34 v184.79,93.98 | v126.68,246.38 126.05,245.75 v126.05,164.46 126.05,144.46 v125.09,143.51 | v90.17,135.25 88.27,135.25
>0_FLAG  (via drill 0.35)
  Top 0.152: v43.5,143.51 57.47,129.54 121.28,129.54 v138.75,112.08 | v176.21,73.03 181.93,67.31 POSITIVE_FLAG.A | ZERO_POS_FLAG_IDENTIFIER.1 207.01,102.87 v174.94,102.87
  Bottom 0.152: AND_GATE4_.5 29.21,261.62 29.21,228.6 39.69,218.12 39.69,193.36 40.64,192.41 40.64,165.42 43.5,162.56 v43.5,143.51 | 161.61,89.22 176.21,74.61 v176.21,73.03 | 161.61,89.22 v138.75,112.08 | v174.94,102.87 161.61,89.53 161.61,89.22
CALC_IN  (via drill 0.35)
  Top 0.152: 211.77,92.71 ADDR_REG_CALC_UPPER.10 | SELECTOR_LOGIC2_.10 92.71,194.31 v105.73,194.31 | v110.17,159.07 110.49,158.75 v138.43,158.75 | v178.44,102.23 180.34,100.33 205.11,100.33 210.82,94.61 | 210.82,94.61 211.77,93.66 211.77,92.71 | 211.77,92.71 ADDR_REG_CALC_UPPER.9 | ADDR_REG_CALC_LOWER.10 230.5,94.61 210.82,94.61
  Bottom 0.152: ADDR_REG_CALC_LOWER.9 ADDR_REG_CALC_LOWER.10 | v105.73,194.31 106.36,193.67 106.36,162.88 v110.17,159.07 | v138.43,158.75 178.44,118.74 v178.44,102.23
CALC_OUT  (via drill 0.35)
  Top 0.152: SELECTOR_LOGIC2_.11 93.66,197.17 94.93,197.17 95.25,196.85 101.92,196.85 v102.23,197.17 | v114.3,153.67 127,153.67 129.54,151.13 132.08,151.13 v139.06,144.14 | v177.48,96.84 179.07,95.25 186.06,95.25 187.32,96.52 OUTPUT_BUFFER_CALC_REG.19
  Bottom 0.152: v102.23,197.17 104.14,195.26 104.14,160.97 110.17,154.94 110.17,154.31 110.81,153.67 v114.3,153.67 | v139.06,144.14 177.48,105.73 v177.48,96.84
CLOCK  (via drill 0.35)
  Top 0.152: 65.09,141.29 66.68,142.88 86.36,142.88 87.63,141.6 INSTRUC_REGISTER_LOWER.7 | RAM_ADDR_LOWER.7 113.67,106.04 93.98,106.04 92.71,107.31 RAM_ADDR_UPPER.7 | 82.87,250.51 84.46,252.09 105.41,252.09 106.68,250.82 ADDR_MEM_REG_LOWER.7 | 34.29,298.45 AND_GATE_.8 | 34.29,298.45 24.13,298.45 21.59,300.99 19.37,300.99 17.46,302.89 17.46,304.16 19.05,304.16 19.69,304.8 NOT_GATE1.11 | v46.04,300.99 38.1,300.99 35.56,298.45 34.29,298.45 | 82.87,250.51 81.28,252.09 v45.4,252.09 | 82.87,250.51 ADDR_MEM_REG_UPPER.7 | 65.09,141.29 63.18,143.19 v46.36,143.19 | 65.09,141.29 INSTRUC_REGISTER_UPPER.7 | PROGRAM_COUNTER_UPPER.2 202.56,323.21 222.25,323.21 223.52,324.49 PROGRAM_COUNTER_LOWER.2 | ADDR_REG_A_UPPER.7 211.46,244.47 v221.3,244.47 231.14,244.47 232.41,245.75 ADDR_REG_A_LOWER.7 | v211.46,23.81 v209.87,22.22 | FLAG_REG_LOWER.7 231.78,47.62 212.09,47.62 210.82,48.89 FLAG_REG_UPPER.7 | v233.68,150.81 v233.68,152.4 | v116.52,38.73 127,28.26 127,25.72 v129.86,25.72
  Bottom 0.152: RAM_ADDR_UPPER.7 91.76,108.9 91.76,136.84 INSTRUC_REGISTER_LOWER.7 | ADDR_REG_PARAM_UPPER.7 113.35,286.07 113.35,281.62 113.98,281.62 114.3,281.31 ADDR_REG_CALC_LOWER1.7 110.81,272.1 110.81,255.59 106.68,251.46 ADDR_MEM_REG_LOWER.7 | 43.82,252.09 43.82,260.67 37.47,267.02 37.47,294 AND_GATE_.8 | 43.82,252.09 43.82,214 INVERTED_CLK_LED.A 44.45,178.12 46.67,175.89 46.67,143.51 v46.36,143.19 | CLOCK.A 60.33,333.38 60.33,313.37 47.94,300.99 v46.04,300.99 | 43.82,252.09 v45.4,252.09 | PROGRAM_COUNTER_LOWER.2 222.88,324.49 222.88,256.86 221.3,255.27 v221.3,244.47 | FLAG_REG_LOWER.7 232.73,50.48 232.73,84.77 ADDR_REG_CALC_LOWER.7 235.9,88.58 235.9,140.65 234.31,142.24 234.31,150.18 v233.68,150.81 | ADDR_REG_CALC_UPPER.7 209.55,50.8 FLAG_REG_UPPER.7 211.14,49.21 211.14,24.13 v211.46,23.81 | v209.87,22.22 209.87,15.24 176.53,15.24 EXTENTION.9 163.83,25.72 v129.86,25.72 | ADDR_REG_A_LOWER.7 233.05,245.75 233.05,208.91 230.82,206.69 230.82,168.27 233.36,165.73 233.36,152.72 v233.68,152.4 | RAM_ADDR_LOWER.7 116.52,107 v116.52,38.73
CTRL_SIG_5_(PC_OUT)  (via drill 0.35)
  Top 0.152: INSRUCTION_REGISTER_SELECTOR_UPPER.13 59.69,124.46 70.48,124.46 71.76,125.73 101.28,125.73 103.82,128.27 v110.17,128.27 | v115.25,154.94 OUTPUT_BUFFER_INSTRUCTION.6
  Bottom 0.152: v110.17,128.27 109.86,128.59 109.86,143.19 111.44,144.78 INSTRUCTION_MEMORY_LOWER.16 115.25,148.27 v115.25,154.94
CTRL_SIG_6_(PC_IN)  (via drill 0.35)
  Top 0.152: INSRUCTION_REGISTER_SELECTOR_UPPER.10 59.69,114.3 76.2,114.3 77.47,113.03 v104.14,113.03 | v106.36,146.69 110.49,146.69 111.12,147.32 INSTRUCTION_MEMORY_LOWER.17 | v114.62,152.4 OUTPUT_BUFFER_INSTRUCTION.7
  Bottom 0.152: v104.14,113.03 104.14,142.88 106.36,145.1 v106.36,146.69 | v114.62,152.4 113.35,151.13 113.35,148.91 INSTRUCTION_MEMORY_LOWER.17
CTRL_SIG_9_(CALC_REG_IN)
  Bottom 0.152: SELECTOR_LOGIC2_.13 94.93,200.98 94.93,189.55 INSTRUCTION_MEMORY_UPPER.11
CTRL_SIG_10_(CALC_REG_OUT)
  Bottom 0.152: SELECTOR_LOGIC2_.14 91.12,204.15 91.12,192.41 92.08,191.45 94.62,191.45 94.62,187.32 INSTRUCTION_MEMORY_UPPER.12
CTRL_SIG_11_(SUM_OUT)  (via drill 0.35)
  Top 0.152: v9.21,269.24 NOT_GATE3_.3 | v35.24,170.81 56.2,191.77 71.76,191.77 80.01,183.51 95.25,183.51 95.89,182.88 INSTRUCTION_MEMORY_UPPER.13
  Bottom 0.152: v9.21,269.24 8.89,268.92 8.89,256.22 8.57,255.91 8.57,197.48 v35.24,170.81
CTRL_SIG_12_(SUBTRACT)  (via drill 0.35)
  Top 0.152: ADDER_LOWER.7 218.76,191.45 210.5,191.45 208.91,193.04 SUBTRACT_INVRTR_LOWER_.9 | INSTRUCTION_MEMORY_UPPER.15 112.71,181.29 116.52,181.29 116.84,181.61 v197.49,181.61 | SUBTRACT_INVRTR_UPPER_.9 208.28,214.63 205.11,214.63 201.3,218.44 SUBTRACT_INVRTR_UPPER_.4
  Bottom 0.152: SUBTRACT_INVRTR_UPPER_.12 206.69,219.39 206.69,214.95 SUBTRACT_INVRTR_UPPER_.9 206.69,211.77 206.69,199.07 | SUBTRACT_INVRTR_LOWER_.9 206.69,194.63 206.69,199.07 | SUBTRACT_INVRTR_LOWER_.12 206.69,199.07 | SUBTRACT_INVRTR_UPPER_.1 199.07,224.47 199.07,220.03 SUBTRACT_INVRTR_UPPER_.4 199.07,216.85 199.07,204.15 | v197.49,181.61 198.75,182.88 198.75,195.9 200.66,197.8 SUBTRACT_INVRTR_LOWER_.4 199.07,199.71 199.07,204.15 | 199.07,204.15 SUBTRACT_INVRTR_LOWER_.1
END_CMD  (via drill 0.35)
  Top 0.152: MICRO_COUNTER_UPPER.1 47.62,169.54 68.58,169.54 70.48,171.45 MICRO_COUNTER_LOWER.1 | AND_GATE4_.8 v37.78,259.08 58.1,259.08 v59.37,260.35 | PROGRAM_COUNTER_UPPER.1 186.37,325.12 v184.15,327.34
  Bottom 0.152: PROGRAM_COUNTER_UPPER.1 199.07,326.07 199.07,328.93 202.25,332.11 202.25,334.01 202.88,334.64 212.41,334.64 212.41,331.47 218.76,325.12 PROGRAM_COUNTER_LOWER.1 | v37.78,259.08 43.5,253.36 43.5,173.67 MICRO_COUNTER_UPPER.1 | v184.15,327.34 184.15,332.74 160.34,356.55 125.41,356.55 122.24,353.38 97.47,353.38 97.47,338.77 96.84,338.14 95.89,338.14 95.89,338.45 95.57,338.77 95.57,340.36 94.62,341.31 76.2,341.31 76.2,277.18 v59.37,260.35
FLAG_OUT  (via drill 0.35)
  Top 0.152: INSTRUCTION_MEMORY_UPPER2.11 118.11,186.69 136.84,186.69 137.48,186.06 v140.97,186.06 | v174.94,152.08 178.12,148.91 193.04,148.91 193.99,147.95 194.63,147.95 196.22,149.54 196.22,151.13 203.52,151.13 204.79,152.4 NOT_GATE_.11
  Bottom 0.152: v174.94,152.08 v140.97,186.06
FLAG_TOGGLE_IN  (via drill 0.35)
  Top 0.152: v108.27,182.88 INSTRUCTION_MEMORY_UPPER.16 | v88.58,229.87 78.11,240.35 38.1,240.35 v23.5,254.95
  Bottom 0.152: v108.27,182.88 107.31,183.83 107.31,208.6 89.85,226.06 89.85,228.6 v88.58,229.87 | v23.5,254.95 23.5,306.7 NOT_GATE1.13
GND  (via drill 0.35)
  Top 0.152: R39.2 R38.2 | R32.2 R33.2 76.2,109.22 RAM_ADDR_UPPER.1 | R36.2 R37.2 73.66,86.36 RAM.1 RAM.2 | R34.2 R35.2 | INSRUCTION_REGISTER_SELECTOR_UPPER.15 INSRUCTION_REGISTER_SELECTOR_UPPER.2 | RAM.14 115.57,85.09 v118.11,85.09 121.28,85.09 123.83,82.55 OUTPUT_BUFFER_RAM.10 | RAM_ADDR_LOWER.1 RAM_ADDR_UPPER.8 | RAM_ADDR_LOWER.8 116.21,109.85 104.14,109.85 102.87,108.58 RAM_ADDR_LOWER.2 | v106.36,66.36 106.05,66.67 102.87,66.67 102.23,66.04 BRANCH_SELECTOR.1 | RAM.26 RAM.25 RAM.24 | RAM.21 97.16,98.42 95.25,98.42 93.98,97.15 RAM.23 | INSTRUCTION_MEMORY_UPPER2.20 133.35,194.31 v119.7,194.31 113.67,194.31 112.4,193.04 INSTRUCTION_MEMORY_UPPER.20 | INSTRUC_REGISTER_UPPER.8 INSTRUC_REGISTER_LOWER.1 INSTRUC_REGISTER_LOWER.2 | MICRO_COUNTER_UPPER.8 64.77,172.72 v65.41,172.72 | R41.1 R45.1 | R43.1 SELECTOR_LOGIC_.8 74.3,193.04 75.56,191.77 85.09,191.77 SELECTOR_LOGIC2_.8 | CLK_TRIGGER.3 16.51,333.06 25.08,333.06 STEPPER_CLOCK.1 26.35,333.69 26.35,339.09 46.04,339.09 47.31,340.36 C2.- | OR_GATE1.7 39.37,295.91 28.58,295.91 27.31,297.18 AND_GATE_.7 | AND_GATE3_.7 26.67,279.4 14.61,279.4 13.34,278.13 NOT_GATE2_.7 | 81.28,209.55 SELECTOR_LOGIC_.15 | 81.28,209.55 83.19,209.55 84.46,210.82 SELECTOR_LOGIC2_.1 | 77.47,209.55 75.56,209.55 74.3,210.82 SELECTOR_LOGIC_.1 | 77.47,209.55 81.28,209.55 | MEMORY.24 MEMORY.23 MEMORY.22 | MEMORY.21 96.2,242.57 | R72.2 R75.2 | ADDR_REG_PARAM_UPPER.2 ADDR_REG_PARAM_UPPER.1 97.79,288.29 R73.2 | 75.56,341.95 77.15,340.36 C1.- | 75.56,341.95 v74.3,343.22 | R44.1 72.39,207.01 74.93,207.01 77.47,209.55 | ADDR_MEM_REG_LOWER.8 109.22,246.06 99.7,246.06 96.2,242.57
  Top 0.152: 96.2,242.57 MEMORY.20 | INSTRUCTIONS_EXTENSION.15 138.43,29.53 167.32,29.53 EXTENTION.11 | R77.1 R78.1 R79.1 | R9.1 R10.1 R11.1 | R13.1 R14.1 | R52.2 246.38,148.59 253.05,148.59 254.32,147.32 R6.2 | R25.2 R24.2 | 167.64,345.44 R27.2 | 167.64,345.44 155.89,345.44 154.62,344.17 R28.2 152.72,344.17 151.45,345.44 139.7,345.44 R29.2 137.16,344.17 R30.2 | R26.2 182.88,345.44 167.64,345.44 | X1.1 254.32,347.66 251.46,347.66 C3.- | OUTPUT_BUFFER_PC.10 181.61,309.88 R16.2 R17.2 | R21.2 R20.2 | R22.2 R23.2 | R18.2 R19.2 | PROGRAM_COUNTER_LOWER.8 236.86,327.02 218.44,327.02 216.53,325.12 PROGRAM_COUNTER_UPPER.8 | ADDR_REG_CALC_UPPER.2 ADDR_REG_CALC_UPPER.1 | LOGIC_SELECTOR-XOR/NOT_UPPER.8 189.23,119.38 v198.75,119.38 200.03,119.38 201.3,118.11 LOGIC_SELECTOR-XOR/NOT_LOWER.8 | NOT_GATE_.7 199.07,145.73 204.15,145.73 204.47,146.05 208.91,146.05 210.19,144.78 AND_GATE1_.7 211.46,144.78 212.72,143.51 v220.66,143.51 223.52,143.51 AND_GATE2_.7 | FLAG_REG_LOWER.1 FLAG_REG_LOWER.2 | v202.88,190.5 SUBTRACT_INVRTR_LOWER_.7 | v202.88,210.82 SUBTRACT_INVRTR_UPPER_.7 | OR_GATE.7 205.11,165.1 206.06,166.05 216.22,166.05 OR_GATE_2.7 v220.98,165.1 | R54.2 R55.2 R56.2 | v193.36,257.49 193.36,259.08 R53.2 | 219.08,246.38 ADDR_REG_A_LOWER.1 | R58.2 R59.2 | ADDR_REG_A_LOWER.8 233.05,248.28 220.98,248.28 219.08,246.38 | 219.08,246.38 ADDR_REG_A_LOWER.2 | OUTPUT_BUFFER_FLAGS.1 180.34,52.07 192.41,52.07 194.94,49.53 FLAG_REG_UPPER.1 | v75.88,342.26 75.56,341.95
  Bottom 0.152: INSRUCTION_REGISTER_SELECTOR_LOWER.8 50.48,91.76 50.48,96.2 INSRUCTION_REGISTER_SELECTOR_LOWER.5 50.48,99.38 50.48,103.5 52.07,105.09 INSRUCTION_REGISTER_SELECTOR_LOWER.2 50.48,107 50.48,111.44 | INSTRUC_REGISTER_UPPER.2 50.48,140.97 | 50.48,140.97 INSTRUC_REGISTER_UPPER.1 | INSRUCTION_REGISTER_SELECTOR_UPPER.8 50.48,111.44 | 50.48,119.06 INSRUCTION_REGISTER_SELECTOR_UPPER.5 | 50.48,111.44 50.48,119.06 | 50.48,126.68 INSRUCTION_REGISTER_SELECTOR_UPPER.2 | 50.48,119.06 50.48,126.68 | 50.48,126.68 50.48,140.97 | 4_INP_OR_GATE.7 77.79,52.39 77.79,56.51 76.84,57.47 71.12,57.47 R39.2 | RAM_ADDR_UPPER.1 RAM_ADDR_UPPER.2 RAM_ADDR_UPPER.15 | INSRUCTION_REGISTER_SELECTOR_UPPER.15 INSRUCTION_REGISTER_SELECTOR_UPPER.14 58.1,124.14 58.1,119.7 INSRUCTION_REGISTER_SELECTOR_UPPER.11 58.1,116.52 58.1,101.28 | INSRUCTION_REGISTER_SELECTOR_LOWER.11 58.1,96.84 58.1,99.06 | 58.1,101.28 58.1,99.06 | 58.1,101.28 INSRUCTION_REGISTER_SELECTOR_LOWER.14 INSRUCTION_REGISTER_SELECTOR_LOWER.15 | 58.1,99.06 66.36,99.06 | 66.36,99.06 R34.2 | R36.2 66.36,89.85 66.36,99.06 | R33.2 70.17,108.27 70.17,100.01 R35.2 | R38.2 70.17,81.6 70.17,87.95 R37.2 | RAM_ADDR_LOWER.1 RAM_ADDR_LOWER.2 RAM_ADDR_LOWER.15 | RAM_ADDR_LOWER.8 v118.11,85.09 | 94.93,140.97 96.52,140.97 INSTRUCTION_MEMORY_LOWER.14 | 94.93,140.97 93.34,140.97 | 93.34,140.97 INSTRUC_REGISTER_LOWER.8 88.9,142.24 MICRO_COUNTER_LOWER.8 | INSTRUCTION_MEMORY_UPPER.14 94.93,178.75 94.93,140.97 | BRANCH_SELECTOR.8 99.7,50.16 99.7,64.13 BRANCH_SELECTOR.1 101.6,75.56 92.39,84.77 | v106.36,66.36 BRANCH_SELECTOR.15 | RAM.20 RAM.21 98.74,96.2 98.74,92.07 95.89,92.07 95.57,92.39 95.57,107.63 RAM_ADDR_UPPER.8
  Bottom 0.152: 93.66,96.52 92.39,96.52 | 92.39,96.52 RAM.24 | RAM.2 85.41,84.77 92.39,84.77 | 92.39,96.52 92.39,84.77 | 93.34,140.97 93.34,117.16 93.66,116.84 93.66,96.52 | 93.66,96.52 RAM.23 | 117.79,274.64 120.65,271.78 OUTPUT_BUFFER_PARAM_REG.10 121.92,262.89 ADDR_MEM_REG_LOWER.8 108.27,249.24 108.27,229.23 109.22,228.28 | 117.79,274.64 ADDR_REG_CALC_LOWER1.8 | ADDR_REG_PARAM_UPPER.8 117.79,286.07 117.79,274.64 | OUTPUT_BUFFER_MEMORY.10 109.22,228.6 109.22,228.28 | 109.22,228.28 MEMORY.14 109.86,226.69 109.86,200.02 INSTRUCTION_MEMORY_UPPER.22 110.17,196.53 110.17,194.63 INSTRUCTION_MEMORY_UPPER.20 109.22,190.5 109.22,162.56 INSTRUCTION_MEMORY_LOWER.22 111.76,159.7 110.17,158.12 110.17,156.53 INSTRUCTION_MEMORY_LOWER.20 | OUTPUT_BUFFER_INSTRUCTION.10 124.78,146.37 124.78,173.67 INSTRUCTION_MEMORY_UPPER2.14 119.7,181.93 v119.7,194.31 | INSTRUCTION_MEMORY_UPPER2.20 131.76,194.63 131.76,196.53 INSTRUCTION_MEMORY_UPPER2.22 | R45.1 59.37,193.99 59.37,202.25 R40.1 | 66.36,141.92 66.04,142.24 66.04,172.08 v65.41,172.72 64.45,173.67 64.45,192.09 R41.1 62.55,193.99 62.55,202.25 R42.1 65.72,203.2 | 66.36,141.92 INSTRUC_REGISTER_UPPER.8 | ADDR_MEM_REG_UPPER.15 ADDR_MEM_REG_UPPER.2 ADDR_MEM_REG_UPPER.1 65.72,248.6 65.72,203.2 | R43.1 67.63,193.99 67.63,202.25 R44.1 65.72,203.2 | AND_GATE3_.7 28.58,278.13 28.58,294 26.67,295.91 AND_GATE_.7 25.08,298.77 25.08,332.42 STEPPER_CLOCK.1 | NOT_GATE1.7 14.29,295.59 14.29,279.72 NOT_GATE2_.7 14.29,276.54 14.29,260.67 NOT_GATE3_.7 11.11,257.49 11.11,238.44 | NOT_GATE5_.7 11.11,222.57 11.11,232.09 | 11.11,238.44 11.11,232.09
  Bottom 0.152: NOT_GATE4_.7 11.11,238.44 | AND_GATE4_.7 25.08,257.49 25.08,236.22 20.96,232.09 11.11,232.09 | SELECTOR_LOGIC2_.15 94.3,209.87 94.3,211.45 93.98,211.77 87.31,211.77 | 87.31,211.77 85.09,211.77 SELECTOR_LOGIC2_.1 | SELECTOR_LOGIC_.1 78.74,215.9 MEMORY.2 | ADDR_MEM_REG_UPPER.8 86.36,248.92 MEMORY.24 87.31,241.62 87.31,211.77 | MEMORY.21 MEMORY.22 ADDR_MEM_REG_LOWER.1 ADDR_MEM_REG_LOWER.2 93.98,256.22 | 93.98,256.22 ADDR_MEM_REG_LOWER.15 | R5.1 50.48,330.52 50.48,333.06 47.31,336.23 47.31,340.36 | 47.31,340.36 51.44,344.49 51.44,345.44 R4.1 74.3,345.44 v74.3,343.22 | 47.31,340.36 C2.- | AUTO_CLOCK.1 93.34,330.83 93.34,330.2 | 93.34,330.2 77.47,330.2 77.47,340.36 C1.- | R75.2 79.06,268.92 79.06,277.18 R74.2 | 89.22,267.97 R69.2 90.17,256.22 93.98,256.22 | 89.22,267.97 R72.2 | R76.2 89.22,277.18 89.22,274.64 | 89.22,267.97 89.22,274.64 | ADDR_REG_CALC_LOWER1.1 ADDR_REG_CALC_LOWER1.2 102.55,276.54 102.55,286.07 ADDR_REG_PARAM_UPPER.2 | 84.14,279.08 R71.2 | 84.14,282.26 84.14,287.34 R70.2 | 84.14,282.26 84.14,279.08 | 84.14,282.26 R73.2 93.98,292.1 93.98,329.56 93.34,330.2 | 89.22,274.64 84.14,274.64 84.14,279.08 | R32.2 66.36,110.17 66.36,141.92 | OUTPUT_BUFFER_REG_A.10 181.61,236.22 OUTPUT_BUFFER_ALU.1 179.7,219.07 179.7,196.22 | 179.7,196.22 179.7,152.4 180.34,152.4 OUTPUT_BUFFER_LOGIC.10 180.34,149.86 180.34,101.28 178.75,99.69 178.75,78.1 180.34,76.52 OUTPUT_BUFFER_CALC_REG.10 OUTPUT_BUFFER_FLAGS.1 178.75,51.75 178.75,30.48 | OUTPUT_BUFFER_ALU.10 179.7,196.22 | 178.75,30.48 168.91,30.48 EXTENTION.11 | 178.75,30.48 OUTPUT_BUFFER_FLAGS.10 | ADDR_REG_A_LOWER.8 249.24,232.09 249.24,216.85